# Altium project PCB_Project1.PrjPCB
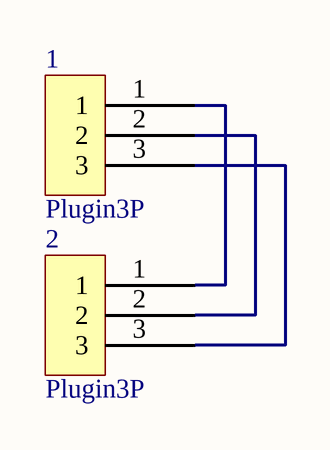
[diagram p0: Sheet1.SchDoc]
1 sheet, 2 parts. Net scope: global (net labels, ports and power ports of the same name join across sheets).
Board file: PCB1.PcbDoc

## Sheet Sheet1.SchDoc
size A4

### Parts
1  Plugin3P  [Plugin3P]
2  Plugin3P  [Plugin3P]

### Nets
Net1_1: 1.1 2.1
Net1_2: 1.2 2.2
Net1_3: 1.3 2.3